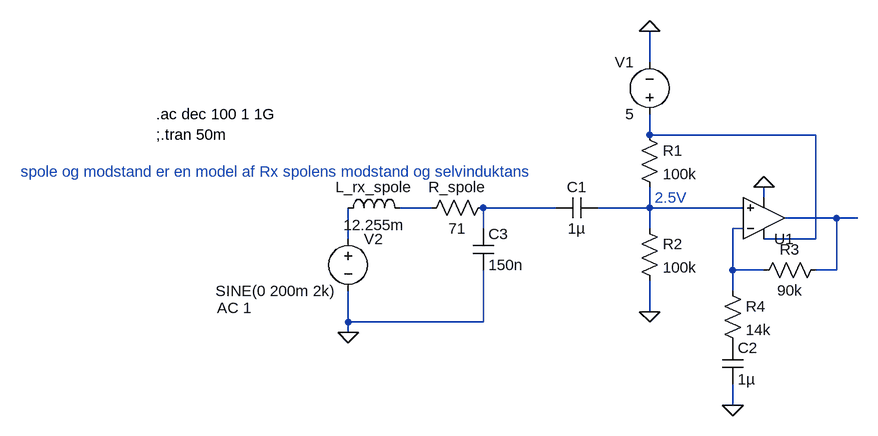
[diagram p0: schematic rx_amplifier.asc]
rx_amplifier.asc, the LTspice schematic file:
Version 4.1
SHEET 1 880 804
WIRE 400 -176 400 -224
WIRE 400 -64 400 -96
WIRE 656 -64 400 -64
WIRE 576 32 576 16
WIRE 64 48 16 48
WIRE 256 48 144 48
WIRE 400 48 400 16
WIRE 400 48 320 48
WIRE 544 48 400 48
WIRE 688 64 608 64
WIRE 720 64 688 64
WIRE 144 80 144 48
WIRE 400 80 400 48
WIRE 544 80 528 80
WIRE -64 96 -64 48
WIRE 656 96 656 -64
WIRE 656 96 576 96
WIRE 528 144 528 80
WIRE 576 144 528 144
WIRE 688 144 688 64
WIRE 688 144 656 144
WIRE 528 176 528 144
WIRE 400 208 400 160
WIRE -64 224 -64 176
WIRE 144 224 144 144
WIRE 144 224 -64 224
WIRE -64 240 -64 224
WIRE 528 352 528 320
FLAG 576 16 0
FLAG 528 352 0
FLAG 400 -224 0
FLAG 400 208 0
FLAG -64 240 0
SYMBOL OpAmps\\UniversalOpAmp 576 64 M180
SYMATTR InstName U1
SYMATTR Value2 Avol=1Meg GBW=1Meg Vos=0
SYMATTR SpiceLine En=0 Enk=0 In=0 Ink=0 Rin=1Meg
SYMBOL voltage 400 -80 R180
WINDOW 0 24 96 Left 2
WINDOW 3 24 16 Left 2
WINDOW 123 0 0 Left 0
WINDOW 39 0 0 Left 0
SYMATTR InstName V1
SYMATTR Value 5
SYMBOL res 384 -80 R0
SYMATTR InstName R1
SYMATTR Value 100k
SYMBOL res 384 64 R0
SYMATTR InstName R2
SYMATTR Value 100k
SYMBOL cap 320 32 R90
WINDOW 0 0 32 VBottom 2
WINDOW 3 32 32 VTop 2
SYMATTR InstName C1
SYMATTR Value 1µ
SYMBOL res 672 128 R90
WINDOW 0 0 56 VBottom 2
WINDOW 3 32 56 VTop 2
SYMATTR InstName R3
SYMATTR Value 90k
SYMBOL res 512 160 R0
SYMATTR InstName R4
SYMATTR Value 14k
SYMBOL cap 512 256 R0
SYMATTR InstName C2
SYMATTR Value 1µ
SYMBOL voltage -64 80 R0
WINDOW 3 -204 96 Left 2
WINDOW 123 -202 122 Left 2
WINDOW 39 0 0 Left 0
SYMATTR Value SINE(0 200m 2k)
SYMATTR Value2 AC 1
SYMATTR InstName V2
SYMBOL ind -80 64 R270
WINDOW 0 32 56 VTop 2
WINDOW 3 5 56 VBottom 2
SYMATTR InstName L_rx_spole
SYMATTR Value 12.255m
SYMBOL res 160 32 R90
WINDOW 0 0 56 VBottom 2
WINDOW 3 32 56 VTop 2
SYMATTR InstName R_spole
SYMATTR Value 71
SYMBOL cap 128 80 R0
SYMATTR InstName C3
SYMATTR Value 150n
TEXT 408 32 Left 2 ;2.5V
TEXT -360 -96 Left 2 !.ac dec 100 1 1G\n;.tran 50m
TEXT -568 -8 Left 2 ;spole og modstand er en model af Rx spolens modstand og selvinduktans

The netlist it stands for:
* rx_amplifier.asc
X§U1 N004 N006 N001 0 N005 level1 Avol=1Meg GBW=1Meg Vos=0 En=0 Enk=0 In=0 Ink=0 Rin=1Meg  ; pins In+ In- V+ V- OUT
V1 N001 0 5
R1 N001 N004 100k
R2 N004 0 100k
C1 N004 N003 1µ
R3 N005 N006 90k
R4 N006 P001 14k
C2 P001 0 1µ
V2 N007 0 SINE(0 200m 2k) AC 1
L_rx_spole N007 N002 12.255m
R_spole N003 N002 71
C3 N003 0 150n
* 2.5V
.ac dec 100 1 1G
;.tran 50m
* spole og modstand er en model af Rx spolens modstand og selvinduktans
.lib UniversalOpAmp1.lib
.backanno
.end